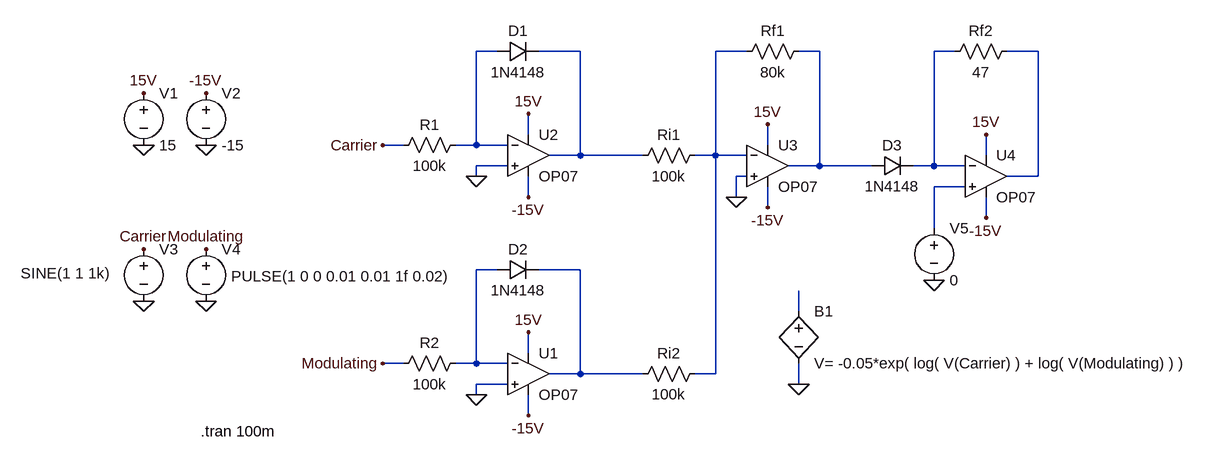
[diagram p0: schematic behavioralSources.asc]
behavioralSources.asc, the LTspice schematic file:
Version 4
SHEET 1 1508 708
WIRE -48 -16 -80 -16
WIRE 80 -16 16 -16
WIRE 336 -16 288 -16
WIRE 448 -16 416 -16
WIRE 656 -16 624 -16
WIRE 784 -16 736 -16
WIRE 0 112 0 80
WIRE -192 128 -224 128
WIRE -80 128 -80 -16
WIRE -80 128 -112 128
WIRE -32 128 -80 128
WIRE 368 128 368 96
WIRE 80 144 80 -16
WIRE 80 144 32 144
WIRE 176 144 80 144
WIRE 288 144 288 -16
WIRE 288 144 256 144
WIRE 336 144 288 144
WIRE 704 144 704 112
WIRE -32 160 -80 160
WIRE 448 160 448 -16
WIRE 448 160 400 160
WIRE 528 160 448 160
WIRE 624 160 624 -16
WIRE 624 160 592 160
WIRE 672 160 624 160
WIRE -80 176 -80 160
WIRE 336 176 320 176
WIRE 784 176 784 -16
WIRE 784 176 736 176
WIRE 672 192 624 192
WIRE 0 208 0 176
WIRE 320 208 320 176
WIRE 368 224 368 192
WIRE 704 240 704 208
WIRE 624 256 624 192
WIRE -48 320 -80 320
WIRE 80 320 16 320
WIRE 416 384 416 352
WIRE 0 448 0 416
WIRE -192 464 -224 464
WIRE -80 464 -80 320
WIRE -80 464 -112 464
WIRE -32 464 -80 464
WIRE 80 480 80 320
WIRE 80 480 32 480
WIRE 176 480 80 480
WIRE 288 480 288 144
WIRE 288 480 256 480
WIRE -32 496 -80 496
WIRE 416 496 416 464
WIRE -80 512 -80 496
WIRE 0 544 0 512
FLAG -80 176 0
FLAG -80 512 0
FLAG -224 464 Modulating
FLAG 320 208 0
FLAG -592 368 0
FLAG -496 368 0
FLAG -496 128 0
FLAG -592 128 0
FLAG -224 128 Carrier
FLAG -592 48 15V
FLAG -496 48 -15V
FLAG -592 288 Carrier
FLAG -496 288 Modulating
FLAG 624 336 0
FLAG 0 80 15V
FLAG 368 96 15V
FLAG 704 112 15V
FLAG 0 416 15V
FLAG 0 208 -15V
FLAG 368 224 -15V
FLAG 704 240 -15V
FLAG 0 544 -15V
FLAG 416 496 0
SYMBOL diode -48 0 R270
WINDOW 0 32 32 VTop 2
WINDOW 3 0 32 VBottom 2
SYMATTR InstName D1
SYMATTR Value 1N4148
SYMBOL res -96 112 R90
WINDOW 0 0 56 VBottom 2
WINDOW 3 32 56 VTop 2
SYMATTR InstName R1
SYMATTR Value 100k
SYMBOL res -96 448 R90
WINDOW 0 0 56 VBottom 2
WINDOW 3 32 56 VTop 2
SYMATTR InstName R2
SYMATTR Value 100k
SYMBOL res 272 128 R90
WINDOW 0 0 56 VBottom 2
WINDOW 3 32 56 VTop 2
SYMATTR InstName Ri1
SYMATTR Value 100k
SYMBOL res 272 464 R90
WINDOW 0 0 56 VBottom 2
WINDOW 3 32 56 VTop 2
SYMATTR InstName Ri2
SYMATTR Value 100k
SYMBOL res 432 -32 R90
WINDOW 0 0 56 VBottom 2
WINDOW 3 32 56 VTop 2
SYMATTR InstName Rf1
SYMATTR Value 80k
SYMBOL voltage -592 32 R0
WINDOW 123 0 0 Left 0
WINDOW 39 0 0 Left 0
SYMATTR InstName V1
SYMATTR Value 15
SYMBOL voltage -496 32 R0
WINDOW 123 0 0 Left 0
WINDOW 39 0 0 Left 0
SYMATTR InstName V2
SYMATTR Value -15
SYMBOL voltage -592 272 R0
WINDOW 123 0 0 Left 0
WINDOW 39 0 0 Left 0
WINDOW 3 -189 53 Left 2
SYMATTR Value SINE(1 1 1k)
SYMATTR InstName V3
SYMBOL voltage -496 272 R0
WINDOW 123 0 0 Left 0
WINDOW 39 0 0 Left 0
WINDOW 3 39 58 Left 2
SYMATTR Value PULSE(1 0 0 0.01 0.01 1f 0.02)
SYMATTR InstName V4
SYMBOL res 752 -32 R90
WINDOW 0 0 56 VBottom 2
WINDOW 3 32 56 VTop 2
SYMATTR InstName Rf2
SYMATTR Value 47
SYMBOL diode -48 336 R270
WINDOW 0 32 32 VTop 2
WINDOW 3 0 32 VBottom 2
SYMATTR InstName D2
SYMATTR Value 1N4148
SYMBOL diode 528 176 R270
WINDOW 0 32 32 VTop 2
WINDOW 3 0 32 VBottom 2
SYMATTR InstName D3
SYMATTR Value 1N4148
SYMBOL Opamps\\OP07 0 416 R0
SYMATTR InstName U1
SYMBOL Opamps\\OP07 0 80 R0
SYMATTR InstName U2
SYMBOL Opamps\\OP07 368 96 R0
SYMATTR InstName U3
SYMBOL Opamps\\OP07 704 112 R0
SYMATTR InstName U4
SYMBOL voltage 624 240 R0
WINDOW 123 0 0 Left 0
WINDOW 39 0 0 Left 0
SYMATTR InstName V5
SYMATTR Value 0
SYMBOL bv 416 368 R0
SYMATTR InstName B1
SYMATTR Value V= -0.05*exp( log( V(Carrier) ) + log( V(Modulating) ) )
TEXT -504 568 Left 2 !.tran 100m

The netlist it stands for:
* behavioralSources.asc
D1 N001 N002 1N4148
R1 N001 Carrier 100k
R2 N008 Modulating 100k
Ri1 N003 N002 100k
Ri2 N003 N009 100k
Rf1 N004 N003 80k
V1 15V 0 15
V2 -15V 0 -15
V3 Carrier 0 SINE(1 1 1k)
V4 Modulating 0 PULSE(1 0 0 0.01 0.01 1f 0.02)
Rf2 N006 N005 47
D2 N008 N009 1N4148
D3 N004 N005 1N4148
XU1 0 N008 15V -15V N009 LT1001  ; OP07, pins In+ In- V+ V- OUT
XU2 0 N001 15V -15V N002 LT1001  ; OP07, pins In+ In- V+ V- OUT
XU3 0 N003 15V -15V N004 LT1001  ; OP07, pins In+ In- V+ V- OUT
XU4 N007 N005 15V -15V N006 LT1001  ; OP07, pins In+ In- V+ V- OUT
V5 N007 0 0
B1 N010 0 V= -0.05*exp( log( V(Carrier) ) + log( V(Modulating) ) )
.model D D
.lib standard.dio
.tran 100m
.lib LTC.lib
.backanno
.end